# Altium schematic sheet ROOT_Sheet.SchDoc: D AMP
size A4; Revision: 1.0; SheetNumber: 5; SheetTotal: 5
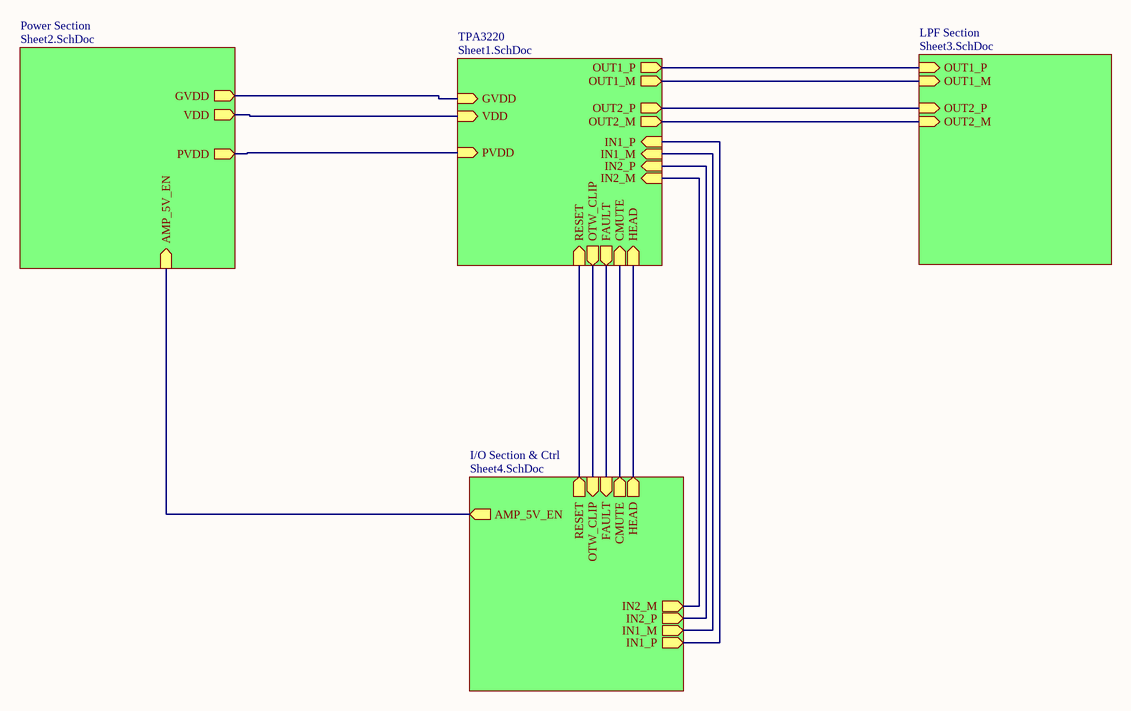
[diagram p0: ROOT_Sheet.SchDoc]

## Sub-sheets
I/O Section & Ctrl = Sheet4.SchDoc: AMP_5V_EN (out), HEAD (out), CMUTE (out), FAULT (in), OTW_CLIP (in), IN1_P (out), IN1_M (out), IN2_P (out), IN2_M (out), RESET (out)
LPF Section = Sheet3.SchDoc: OUT1_P (in), OUT1_M (in), OUT2_P (in), OUT2_M (in)
Power Section = Sheet2.SchDoc: GVDD (out), VDD (out), PVDD (out), AMP_5V_EN (in)
TPA3220 = Sheet1.SchDoc: GVDD (in), VDD (in), PVDD (in), OTW_CLIP (out), FAULT (out), CMUTE (in), HEAD (in), OUT1_P (out), OUT1_M (out), OUT2_P (out), OUT2_M (out), IN1_P (in), IN1_M (in), IN2_P (in), IN2_M (in), RESET (in)

## Nets
(unnamed): sheet TPA3220/GVDD, sheet Power Section/GVDD
(unnamed): sheet TPA3220/VDD, sheet Power Section/VDD
(unnamed): sheet TPA3220/PVDD, sheet Power Section/PVDD
(unnamed): sheet TPA3220/OTW_CLIP, sheet I/O Section & Ctrl/OTW_CLIP
(unnamed): sheet TPA3220/FAULT, sheet I/O Section & Ctrl/FAULT
(unnamed): sheet TPA3220/CMUTE, sheet I/O Section & Ctrl/CMUTE
(unnamed): sheet TPA3220/HEAD, sheet I/O Section & Ctrl/HEAD
(unnamed): sheet TPA3220/OUT1_P, sheet LPF Section/OUT1_P
(unnamed): sheet TPA3220/OUT1_M, sheet LPF Section/OUT1_M
(unnamed): sheet TPA3220/OUT2_P, sheet LPF Section/OUT2_P
(unnamed): sheet TPA3220/OUT2_M, sheet LPF Section/OUT2_M
(unnamed): sheet TPA3220/IN1_P, sheet I/O Section & Ctrl/IN1_P
(unnamed): sheet TPA3220/IN1_M, sheet I/O Section & Ctrl/IN1_M
(unnamed): sheet TPA3220/IN2_P, sheet I/O Section & Ctrl/IN2_P
(unnamed): sheet TPA3220/IN2_M, sheet I/O Section & Ctrl/IN2_M
(unnamed): sheet TPA3220/RESET, sheet I/O Section & Ctrl/RESET
(unnamed): sheet I/O Section & Ctrl/AMP_5V_EN, sheet Power Section/AMP_5V_EN

## Notes on the sheet
- Size:
- Date:
- A4
- Author:
- Time:
- Title
- Lovepreet Singh
- Sheet
- Revision:
- of
- File: